# EAGLE design bigmaker (EAGLE 9.7.0)
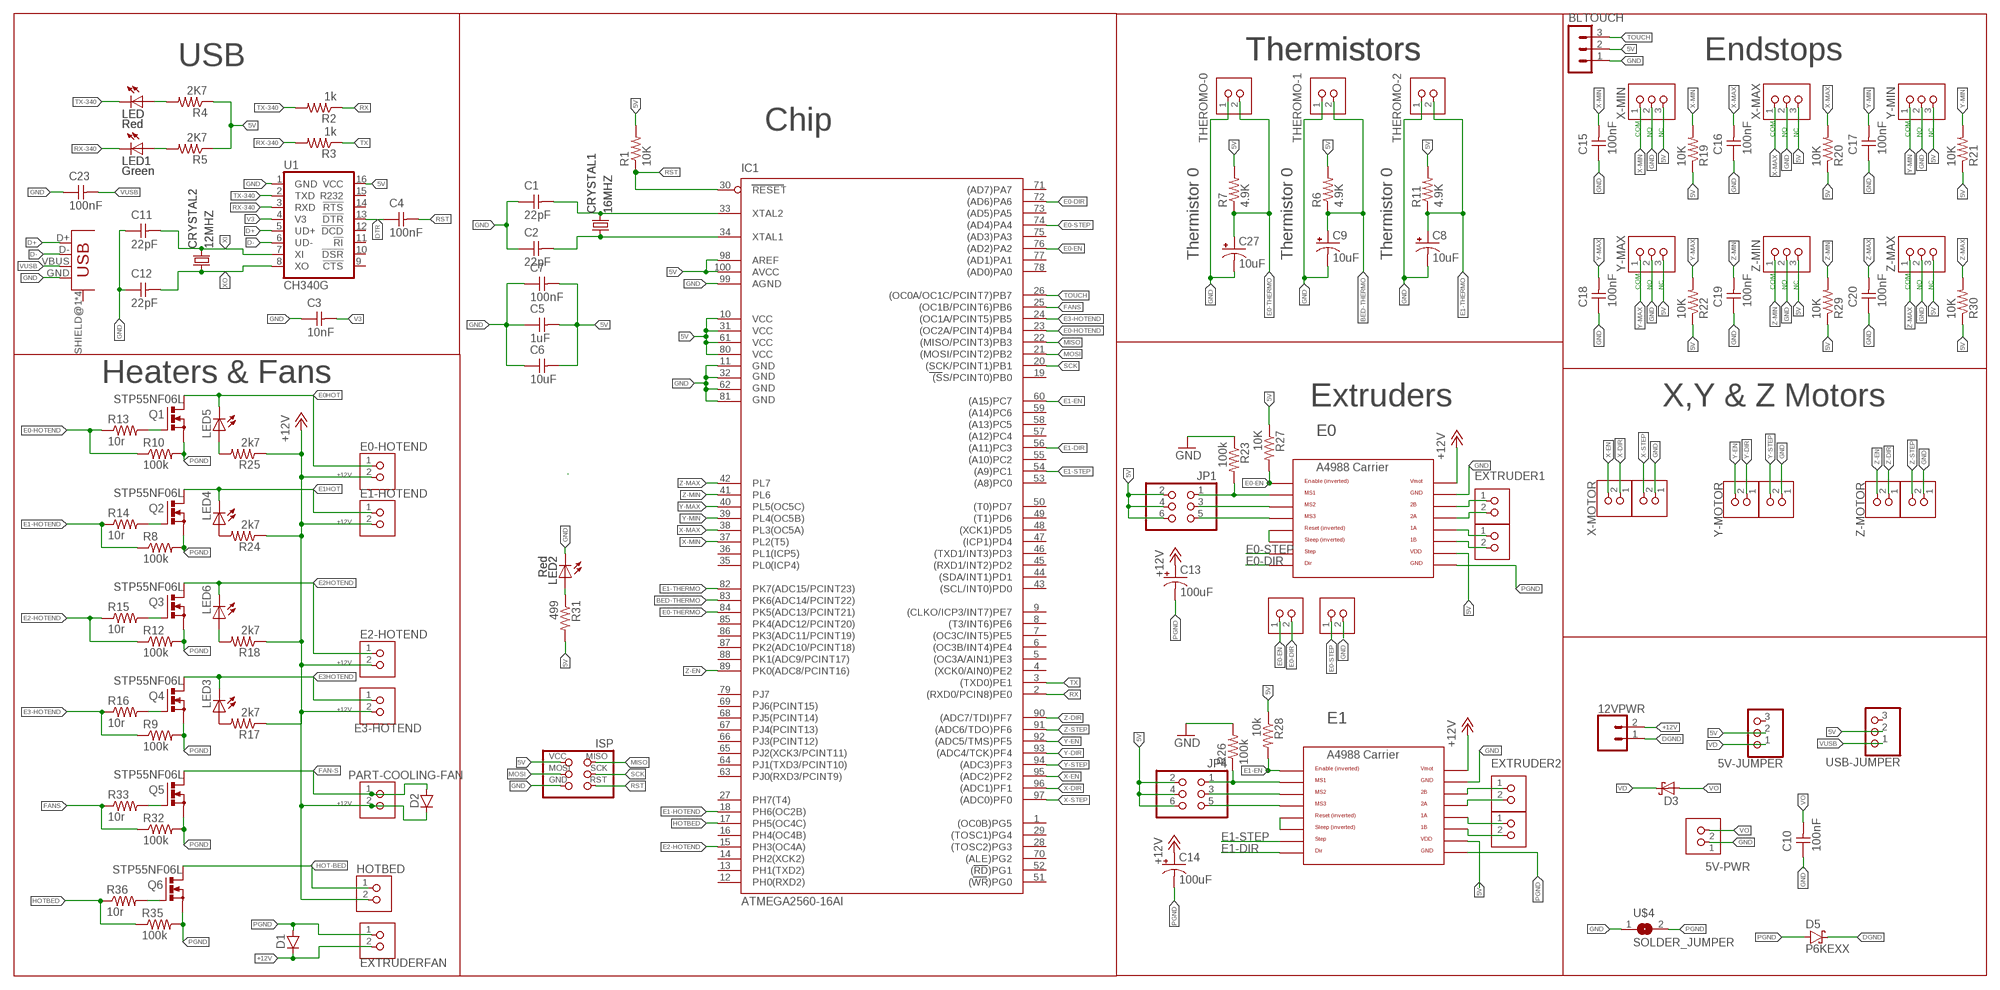
[diagram p0: schematic, sheet 1]

## Parts
5V-JUMPER  PINHD-1X3  [1X03]
5V-PWR  TERM-1X02-FABLAB  [ED555DS-2DS]
12VPWR  CONN_025MM  [SCREWTERMINAL-5MM-2]
BLTOUCH  MA03-1  [MA03-1]
C1  22pF  CAP-UNPOLARIZEDFAB  [C1206FAB]
C2  22pF  CAP-UNPOLARIZEDFAB  [C1206FAB]
C3  10nF  CAP-UNPOLARIZEDFAB  [C1206FAB]
C4  100nF  CAP-UNPOLARIZEDFAB  [C1206FAB]
C5  1uF  CAP-UNPOLARIZEDFAB  [C1206FAB]
C6  10uF  CAP-UNPOLARIZEDFAB  [C1206FAB]
C7  100nF  CAP-UNPOLARIZEDFAB  [C1206FAB]
C8  10uF  CPOL-US153CLV-0405  [153CLV-0405]
C9  10uF  CPOL-US153CLV-0405  [153CLV-0405]
C10  100nF  CAP-UNPOLARIZEDFAB  [C1206FAB]
C11  22pF  CAP-UNPOLARIZEDFAB  [C1206FAB]
C12  22pF  CAP-UNPOLARIZEDFAB  [C1206FAB]
C13  100uF  CPOL-US153CLV-0605  [153CLV-0605]
C14  100uF  CPOL-US153CLV-0605  [153CLV-0605]
C15  100nF  CAP-UNPOLARIZEDFAB  [C1206FAB]
C16  100nF  CAP-UNPOLARIZEDFAB  [C1206FAB]
C17  100nF  CAP-UNPOLARIZEDFAB  [C1206FAB]
C18  100nF  CAP-UNPOLARIZEDFAB  [C1206FAB]
C19  100nF  CAP-UNPOLARIZEDFAB  [C1206FAB]
C20  100nF  CAP-UNPOLARIZEDFAB  [C1206FAB]
C23  100nF  CAP-UNPOLARIZEDFAB  [C1206FAB]
C27  10uF  CPOL-US153CLV-0405  [153CLV-0405]
CRYSTAL1  16MHZ  CSM-7X-DU  [CSM-7X-DU]
CRYSTAL2  12MHZ  CSM-7X-DU  [CSM-7X-DU]
D1  CDBM1100-G  [MINI-SMA]
D2  CDBM1100-G  [MINI-SMA]
D3  SCHOTTKY-DIODEDO35-7  [DO35-7]
D5  P6KEXX  [CB417-15]
E0-HOTEND  TERM-1X02-FABLAB  [ED555DS-2DS]
E1-HOTEND  TERM-1X02-FABLAB  [ED555DS-2DS]
E2-HOTEND  TERM-1X02-FABLAB  [ED555DS-2DS]
E3-HOTEND  TERM-1X02-FABLAB  [ED555DS-2DS]
EXTERNAL-EXTRUDER  TERM-1X02-FABLAB  [ED555DS-2DS]
EXTRUDER1  TERM-1X02-FABLAB  [ED555DS-2DS]
EXTRUDER2  TERM-1X02-FABLAB  [ED555DS-2DS]
EXTRUDER11  TERM-1X02-FABLAB  [ED555DS-2DS]
EXTRUDER22  TERM-1X02-FABLAB  [ED555DS-2DS]
EXTRUDERFAN  TERM-1X02-FABLAB  [ED555DS-2DS]
HOTBED  TERM-1X02-FABLAB  [ED555DS-2DS]
IC1  ATMEGA2560-16AI  [TQFP100]
ISP  AVRISPSMD  [2X03SMD]
JP1  PINHD-2X3  [2X03]
JP4  PINHD-2X3  [2X03]
LED  Red  LEDFAB1206  [LED1206FAB]
LED1  Green  LEDFAB1206  [LED1206FAB]
LED2  Red  LEDFAB1206  [LED1206FAB]
LED3  LEDFAB1206  [LED1206FAB]
LED4  LEDFAB1206  [LED1206FAB]
LED5  LEDFAB1206  [LED1206FAB]
LED6  LEDFAB1206  [LED1206FAB]
PART-COOLING-FAN  TERM-1X02-FABLAB  [ED555DS-2DS]
Q1  STP55NF06L  IRF512  [TO220BV]
Q2  STP55NF06L  IRF512  [TO220BV]
Q3  STP55NF06L  IRF512  [TO220BV]
Q4  STP55NF06L  IRF512  [TO220BV]
Q5  STP55NF06L  IRF512  [TO220BV]
Q6  STP55NF06L  IRF512  [TO220BV]
R1  10K  RES-US1206FAB  [R1206FAB]
R2  1k  RES-US1206FAB  [R1206FAB]
R3  1k  RES-US1206FAB  [R1206FAB]
R4  2K7  RES-US1206FAB  [R1206FAB]
R5  2K7  RES-US1206FAB  [R1206FAB]
R6  4.9K  RES-US1206FAB  [R1206FAB]
R7  4.9K  RES-US1206FAB  [R1206FAB]
R8  100k  RES-US1206FAB  [R1206FAB]
R9  100k  RES-US1206FAB  [R1206FAB]
R10  100k  RES-US1206FAB  [R1206FAB]
R11  4.9K  RES-US1206FAB  [R1206FAB]
R12  100k  RES-US1206FAB  [R1206FAB]
R13  10r  RES-US1206FAB  [R1206FAB]
R14  10r  RES-US1206FAB  [R1206FAB]
R15  10r  RES-US1206FAB  [R1206FAB]
R16  10r  RES-US1206FAB  [R1206FAB]
R17  2k7  RES-US1206FAB  [R1206FAB]
R18  2k7  RES-US1206FAB  [R1206FAB]
R19  10K  RES-US1206FAB  [R1206FAB]
R20  10K  RES-US1206FAB  [R1206FAB]
R21  10K  RES-US1206FAB  [R1206FAB]
R22  10K  RES-US1206FAB  [R1206FAB]
R23  100k  RES-US1206FAB  [R1206FAB]
R24  2k7  RES-US1206FAB  [R1206FAB]
R25  2k7  RES-US1206FAB  [R1206FAB]
R26  100k  RES-US1206FAB  [R1206FAB]
R27  10K  RES-US1206FAB  [R1206FAB]
R28  10k  RES-US1206FAB  [R1206FAB]
R29  10K  RES-US1206FAB  [R1206FAB]
R30  10K  RES-US1206FAB  [R1206FAB]
R31  499  RES-US1206FAB  [R1206FAB]
R32  100k  RES-US1206FAB  [R1206FAB]
R33  10r  RES-US1206FAB  [R1206FAB]
R35  100k  RES-US1206FAB  [R1206FAB]
R36  10r  RES-US1206FAB  [R1206FAB]
THEROMO-0  TERM-1X02-FABLAB  [ED555DS-2DS]
THEROMO-1  TERM-1X02-FABLAB  [ED555DS-2DS]
THEROMO-2  TERM-1X02-FABLAB  [ED555DS-2DS]
U1  CH340G  CH340GSMD  [SO016]
U$1  USB_MINIB  [USB_MINIB]
U$2  A4988BREAKOUT  [A4988BREAKOUT]
U$3  A4988BREAKOUT  [A4988BREAKOUT]
U$4  SOLDER_JUMPER  [SJFAB]
USB-JUMPER  PINHD-1X3  [1X03]
X-MAX  TERM-1X03'-FABLAB'  [ED555DS-3DS]
X-MIN  TERM-1X03'-FABLAB'  [ED555DS-3DS]
X-MOTOR  TERM-1X02-FABLAB  [ED555DS-2DS]
X-MOTOR2  TERM-1X02-FABLAB  [ED555DS-2DS]
XMOTOR2  TERM-1X02-FABLAB  [ED555DS-2DS]
Y-MAX  TERM-1X03'-FABLAB'  [ED555DS-3DS]
Y-MIN  TERM-1X03'-FABLAB'  [ED555DS-3DS]
Y-MOTOR  TERM-1X02-FABLAB  [ED555DS-2DS]
YMOTOR2  TERM-1X02-FABLAB  [ED555DS-2DS]
Z-MAX  TERM-1X03'-FABLAB'  [ED555DS-3DS]
Z-MIN  TERM-1X03'-FABLAB'  [ED555DS-3DS]
Z-MOTOR  TERM-1X02-FABLAB  [ED555DS-2DS]
Z-MOTOR2  TERM-1X02-FABLAB  [ED555DS-2DS]

## Nets
5V: 5V-JUMPER.2 BLTOUCH.2 C5.2 C6.2 C7.2 IC1.10(VCC) IC1.31(VCC1) IC1.61(VCC2) IC1.80(VCC3) IC1.98(AREF) IC1.100(AVCC) ISP.2(VCC) JP1.2 JP1.4 JP1.6 JP4.2 JP4.4 JP4.6 R1.2 R4.1 R5.1 R6.2 R7.2 R11.2 R19.1 R20.1 R21.1 R22.1 R27.1 R28.1 R29.1 R30.1 R31.2 U1.16(VCC) U$2.VDD U$3.VDD USB-JUMPER.2 X-MAX.3 X-MIN.3 Y-MAX.3 Y-MIN.3 Z-MAX.3 Z-MIN.3
+12V: 12VPWR.2 C13.+ C14.+ D1.KATHODE D2.KATHODE E0-HOTEND.2 E1-HOTEND.2 E2-HOTEND.2 E3-HOTEND.2 EXTRUDERFAN.2 HOTBED.2 PART-COOLING-FAN.2 R17.1 R18.1 R24.1 R25.1 U$2.VMOT U$3.VMOT
BED-THERMO: C9.+ IC1.83(PK6(ADC14/PCINT22)) R6.1 THEROMO-1.2
D+: U1.5(UD+) U$1.D+
D-: U1.6(UD-) U$1.D-
DGND: 12VPWR.1 D5.C
DTR: C4.1 U1.13(!DTR)
E0-DIR: EXTERNAL-EXTRUDER.2 IC1.72((AD6)PA6) U$2.DIR
E0-EN: EXTERNAL-EXTRUDER.1 IC1.76((AD2)PA2) R27.2 U$2.EN
E0-HOTEND: IC1.23((OC2A/PCINT4)PB4) R10.1 R13.1
E0-STEP: IC1.74((AD4)PA4) U$2.STEP X-MOTOR2.1
E0-THERMO: C27.+ IC1.84(PK5(ADC13/PCINT21)) R7.1 THEROMO-0.2
E0HOT: E0-HOTEND.1 LED5.2(C) Q1.D
E1-DIR: IC1.56((A11)PC3) U$3.DIR
E1-EN: IC1.60((A15)PC7) R28.2 U$3.EN
E1-HOTEND: IC1.18(PH6(OC2B)) R8.1 R14.1
E1-STEP: IC1.54((A9)PC1) U$3.STEP
E1-THERMO: C8.+ IC1.82(PK7(ADC15/PCINT23)) R11.1 THEROMO-2.2
E1HOT: E1-HOTEND.1 LED4.2(C) Q2.D
E2-HOTEND: IC1.15(PH3(OC4A)) R12.1 R15.1
E2HOTEND: E2-HOTEND.1 LED6.2(C) Q3.D
E3-HOTEND: IC1.24((OC1A/PCINT5)PB5) R9.1 R16.1
E3HOTEND: E3-HOTEND.1 LED3.2(C) Q4.D
FAN-S: D2.ANODE PART-COOLING-FAN.1 Q5.D
FANS: IC1.25((OC1B/PCINT6)PB6) R32.1 R33.1
GND: 5V-PWR.1 BLTOUCH.1 C1.1 C2.1 C3.1 C5.1 C6.1 C7.1 C8.- C9.- C10.1 C11.1 C12.1 C15.1 C16.1 C17.1 C18.1 C19.1 C20.1 C23.1 C27.- IC1.11(GND) IC1.32(GND1) IC1.62(GND2) IC1.81(GND3) IC1.99(AGND) ISP.6(GND) LED2.2(C) R23.1 R26.2 THEROMO-0.1 THEROMO-1.1 THEROMO-2.1 U1.1(GND) U$1.GND U$2.GND U$3.GND U$4.1 X-MAX.2 X-MIN.2 X-MOTOR2.2 XMOTOR2.1 Y-MAX.2 Y-MIN.2 YMOTOR2.1 Z-MAX.2 Z-MIN.2 Z-MOTOR2.1
HOT-BED: HOTBED.1 Q6.D
HOTBED: IC1.17(PH5(OC4C)) R35.1 R36.1
MISO: IC1.22((MISO/PCINT3)PB3) ISP.1(MISO)
MOSI: IC1.21((MOSI/PCINT2)PB2) ISP.4(MOSI)
N$1: C1.2 CRYSTAL1.2 IC1.33(XTAL2)
N$2: C2.2 CRYSTAL1.1 IC1.34(XTAL1)
N$3: LED2.1(A) R31.1
N$4: EXTRUDER22.1 U$3.2B
N$5: EXTRUDER22.2 U$3.2A
N$6: EXTRUDER2.1 U$3.1A
N$7: LED.1(A) R4.2
N$8: LED1.1(A) R5.2
N$9: EXTRUDER2.2 U$3.1B
N$10: Q5.G R33.2
N$12: Q4.G R16.2
N$13: Q3.G R15.2
N$14: LED3.1(A) R17.2
N$15: LED6.1(A) R18.2
N$16: Q6.G R36.2
N$29: JP1.5 U$2.MS3
N$30: U$2.RST U$2.SLP(SLEEP)
N$31: U$3.RST U$3.SLP(SLEEP)
N$32: JP4.1 R26.1 U$3.MS1
N$33: JP1.1 R23.2 U$2.MS1
N$36: JP1.3 U$2.MS2
N$37: JP4.5 U$3.MS3
N$38: JP4.3 U$3.MS2
N$39: EXTRUDER11.1 U$2.2B
N$40: EXTRUDER11.2 U$2.2A
N$41: EXTRUDER1.1 U$2.1A
N$42: EXTRUDER1.2 U$2.1B
N$45: LED4.1(A) R24.2
N$47: Q2.G R14.2
N$48: Q1.G R13.2
N$50: LED5.1(A) R25.2
PGND: C13.- C14.- D1.ANODE D5.A EXTRUDERFAN.1 Q1.S Q2.S Q3.S Q4.S Q5.S Q6.S R8.2 R9.2 R10.2 R12.2 R32.2 R35.2 U$2.GND@0(GND) U$3.GND@0(GND) U$4.2
RST: C4.2 IC1.30(RESET) ISP.5(RST) R1.1
RX: IC1.2((RXD0/PCIN8)PE0) R2.1
RX-340: LED1.2(C) R3.2 U1.3(RXD)
SCK: IC1.20((SCK/PCINT1)PB1) ISP.3(SCK)
TOUCH: BLTOUCH.3 IC1.26((OC0A/OC1C/PCINT7)PB7)
TX: IC1.3((TXD0)PE1) R3.1
TX-340: LED.2(C) R2.2 U1.2(TXD)
V3: C3.2 U1.4(V3)
VD: 5V-JUMPER.1 D3.C
VO: 5V-PWR.2 C10.2 D3.A
VUSB: C23.2 U$1.VBUS USB-JUMPER.1
X-DIR: IC1.96((ADC1)PF1) X-MOTOR.1
X-EN: IC1.95((ADC2)PF2) X-MOTOR.2
X-MAX: C16.2 IC1.38(PL3(OC5A)) R20.2 X-MAX.1
X-MIN: C15.2 IC1.37(PL2(T5)) R19.2 X-MIN.1
X-STEP: IC1.97((ADC0)PF0) XMOTOR2.2
XI: C11.2 CRYSTAL2.2 U1.7(XI)
XO: C12.2 CRYSTAL2.1 U1.8(XO)
Y-DIR: IC1.93((ADC4/TCK)PF4) Y-MOTOR.1
Y-EN: IC1.92((ADC5/TMS)PF5) Y-MOTOR.2
Y-MAX: C18.2 IC1.40(PL5(OC5C)) R22.2 Y-MAX.1
Y-MIN: C17.2 IC1.39(PL4(OC5B)) R21.2 Y-MIN.1
Y-STEP: IC1.94((ADC3)PF3) YMOTOR2.2
Z-DIR: IC1.90((ADC7/TDI)PF7) Z-MOTOR.1
Z-EN: IC1.89(PK0(ADC8/PCINT16)) Z-MOTOR.2
Z-MAX: C20.2 IC1.42(PL7) R30.2 Z-MAX.1
Z-MIN: C19.2 IC1.41(PL6) R29.2 Z-MIN.1
Z-STEP: IC1.91((ADC6/TDO)PF6) Z-MOTOR2.2
Unconnected: 5V-JUMPER.3 IC1.1((OC0B)PG5) IC1.4((XCK0/AIN0)PE2) IC1.5((OC3A/AIN1)PE3) IC1.6((OC3B/INT4)PE4) IC1.7((OC3C/INT5)PE5) IC1.8((T3/INT6)PE6) IC1.9((CLKO/ICP3/INT7)PE7) IC1.12(PH0(RXD2)) IC1.13(PH1(TXD2)) IC1.14(PH2(XCK2)) IC1.16(PH4(OC4B)) IC1.19((SS/PCINT0)PB0) IC1.27(PH7(T4)) IC1.28((TOSC2)PG3) IC1.29((TOSC1)PG4) IC1.35(PL0(ICP4)) IC1.36(PL1(ICP5)) IC1.43((SCL/INT0)PD0) IC1.44((SDA/INT1)PD1) IC1.45((RXD1/INT2)PD2) IC1.46((TXD1/INT3)PD3) IC1.47((ICP1)PD4) IC1.48((XCK1)PD5) IC1.49((T1)PD6) IC1.50((T0)PD7) IC1.51((WR)PG0) IC1.52((RD)PG1) IC1.53((A8)PC0) IC1.55((A10)PC2) IC1.57((A12)PC4) IC1.58((A13)PC5) IC1.59((A14)PC6) IC1.63(PJ0(RXD3/PCINT9)) IC1.64(PJ1(TXD3/PCINT10)) IC1.65(PJ2(XCK3/PCINT11)) IC1.66(PJ3(PCINT12)) IC1.67(PJ4(PCINT13)) IC1.68(PJ5(PCINT14)) IC1.69(PJ6(PCINT15)) IC1.70((ALE)PG2) IC1.71((AD7)PA7) IC1.73((AD5)PA5) IC1.75((AD3)PA3) IC1.77((AD1)PA1) IC1.78((AD0)PA0) IC1.79(PJ7) IC1.85(PK4(ADC12/PCINT20)) IC1.86(PK3(ADC11/PCINT19)) IC1.87(PK2(ADC10/PCINT18)) IC1.88(PK1(ADC9/PCINT17)) U1.9(!CTS) U1.10(!DSR) U1.11(!RI) U1.12(!DCD) U1.14(!RTS) U1.15(R232) U$1.SHIELD@1(SHIELD) U$1.SHIELD@2(SHIELD) U$1.SHIELD@3(SHIELD) U$1.SHIELD@4(SHIELD) USB-JUMPER.3

## Notes on the sheet
- USB | Thermistors | Thermistors | Endstops
- Chip
- COM | NO | NC | COM | NO | NC | COM | NO | NC
- Thermistor 0 | Thermistor 0 | Thermistor 0
- COM | NO | NC | COM | NO | NC | COM | NO | NC
- Heaters & Fans
- Extruders | X,Y & Z Motors
- E0
- E1

## Library data of the parts
5V-JUMPER USB-JUMPER = pinhead:PINHD-1X3: PIN HEADER
5V-PWR E0-HOTEND E1-HOTEND E2-HOTEND E3-HOTEND EXTERNAL-EXTRUDER EXTRUDER1 EXTRUDER2 EXTRUDER11 EXTRUDER22 EXTRUDERFAN HOTBED PART-COOLING-FAN THEROMO-0 THEROMO-1 THEROMO-2 X-MOTOR X-MOTOR2 XMOTOR2 Y-MOTOR YMOTOR2 Z-MOTOR Z-MOTOR2 = fab:TERM-1X02: 3.5mm terminal block, 2 positions ED555-2DS as found in the fablab inventory. Stolen from Adafruit <http://www.ladyada.net/library/pcb/eaglelibrary.html>, adapted by Zaerc.
12VPWR = SparkFun-Retired:CONN_02: Multi connection point. Often used as Generic Header-pin footprint for 0.1 inch spaced/style header connections On any of the 0.1 inch spaced packages, you can populate with these: Break Away Headers - Straight <https://www.sparkfun.com/products/116> (PRT-00116) Break Away Male Headers - Right Angle <https://www.sparkfun.com/products/553> (PRT-00553) Female Headers <https://www.sparkfun.com/products/115> (PRT-00115) Break Away Headers - Machine Pin <https://www.sparkfun.com/products/117> (PRT-00117) Break Away Female Headers - Swiss Machine Pin <https://www.sparkfun.com/products/743> (PRT-00743) For SCREWTERMINALS and SPRING TERMINALS visit here: Screw Terimnals on SparkFun.com <https://www.sparkfun.com/search/results?term=Screw+Terminals> (5mm/3.5mm/2.54mm spacing) This device is also useful as a general connection point to wire up your design to another part of your project. Our various solder wires solder well into these plated through hole pads. Hook-Up Wire - Assortment (Stranded, 22 AWG) <https://www.sparkfun.com/products/11375> (PRT-11375) Hook-Up Wire - Assortment (Solid Core, 22 AWG) <https://www.sparkfun.com/products/11367> (PRT-11367) View the entire wire category on our website here <https://www.sparkfun.com/categories/141> Special notes: Molex polarized connector foot print use with: PRT-08233 with associated crimp pins and housings. 2.54_SCREWTERM for use with PRT-10571. 3.5mm Screw Terminal footprints for PRT-08084 5mm Screw Terminal footprints for use with PRT-08432; SF_SKU: PRT-08432
BLTOUCH = MACHINE:MA03-1: PIN HEADER; OC_FARNELL: unknown; OC_NEWARK: unknown
C1-C7 C10-C12 C15-C20 C23 = fab:CAP-UNPOLARIZED
C8 C9 C13 C14 C27 = adafruit:CPOL-US: POLARIZED CAPACITOR, American symbol
CRYSTAL1 CRYSTAL2 = bigfdmmain:CSM-7X-DU: SMD CRYSTAL Source: www.ecsxtal.com .. Crystal 3.6864MHz CSM_7X_DU.PDF; OC_FARNELL: unknown; OC_NEWARK: unknown
D1 D2 = fab:CDBM1100-G: Diode schottky 100V 1A mini-SMA as found in the fablab inventory Reverse Voltage: 100 Volts Forward Current: 1.0 Amp Maximum forward voltage: 0.85 Volts Made by Zaerc.
D3 = adafruit:SCHOTTKY-DIODE: Schottky Diode
D5 = diode:P6KEXX: DIODE transient-voltage suppressor
IC1 = atmel-2005:ATMEGA*: MICROCONTROLLER 64/128/256 Kbytes FLASH 4 Kbytes EEPROM 8 Kbytes SRAM 86 General Purpose I/O pins 12-channels16-bit PWM 4 x Serial USARTs 16-channels 10-bit A/D
ISP = fab:AVRISP
JP1 JP4 = pinhead:PINHD-2X3: PIN HEADER
LED LED1 LED2 = bigfdmmain:LED*?: LED
LED3-LED6 = fab:LED: LED
Q1-Q6 = transistor-power:IRF512: N-CHANNEL MOS FET
R1-R5 = bigfdmmain:RES-US: Resistor (US Symbol) Variants with postfix FAB are widened to allow the routing of internal traces
R6-R33 R35 R36 = fab:RES-US: Resistor (US Symbol) Variants with postfix FAB are widened to allow the routing of internal traces
U1 = bigfdmmain:CH340G: A simple USB 2.0 to Serial IC.; PROD_ID: IC-13498
U$1 = MACHINE:USB_MINIB
U$2 U$3 = RepRapjr:A4988BREAKOUT
U$4 = fab:SOLDER_JUMPER
X-MAX X-MIN Y-MAX Y-MIN Z-MAX Z-MIN = fab:TERM-1X03: 3.5mm terminal block, 3 positions ED555-3DS as found in the fablab inventory. Made by Zaerc.

## Board
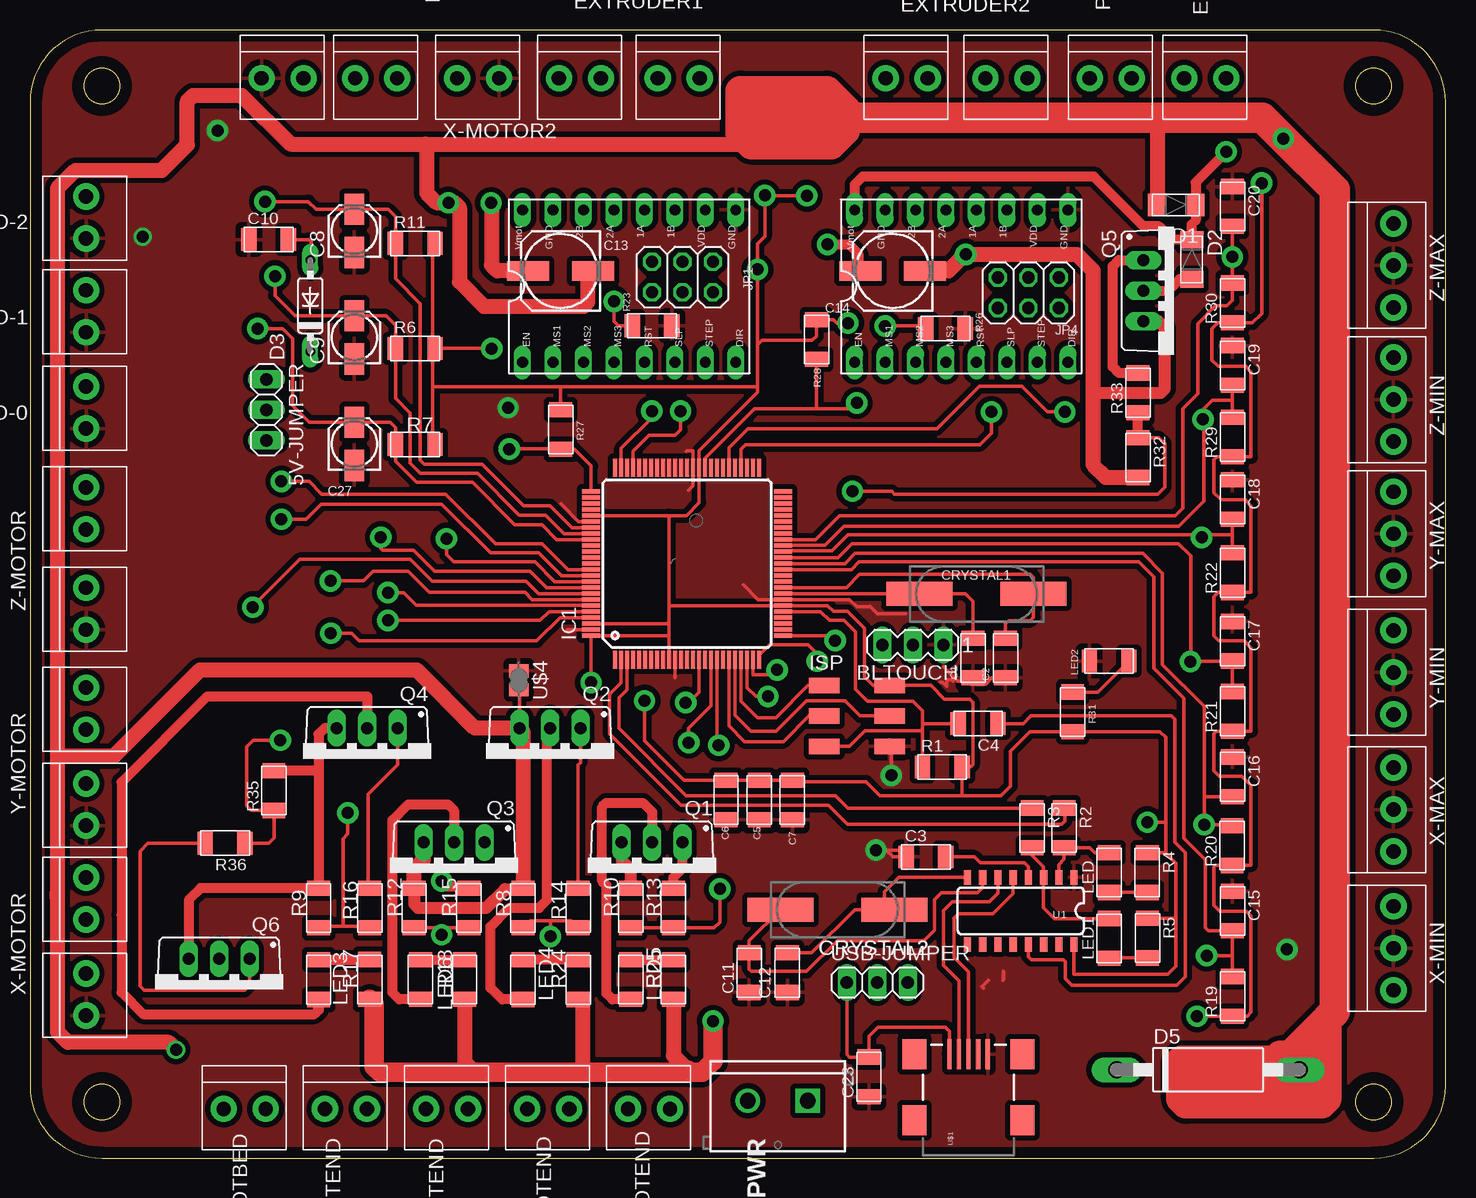
[diagram p1: board, top side]
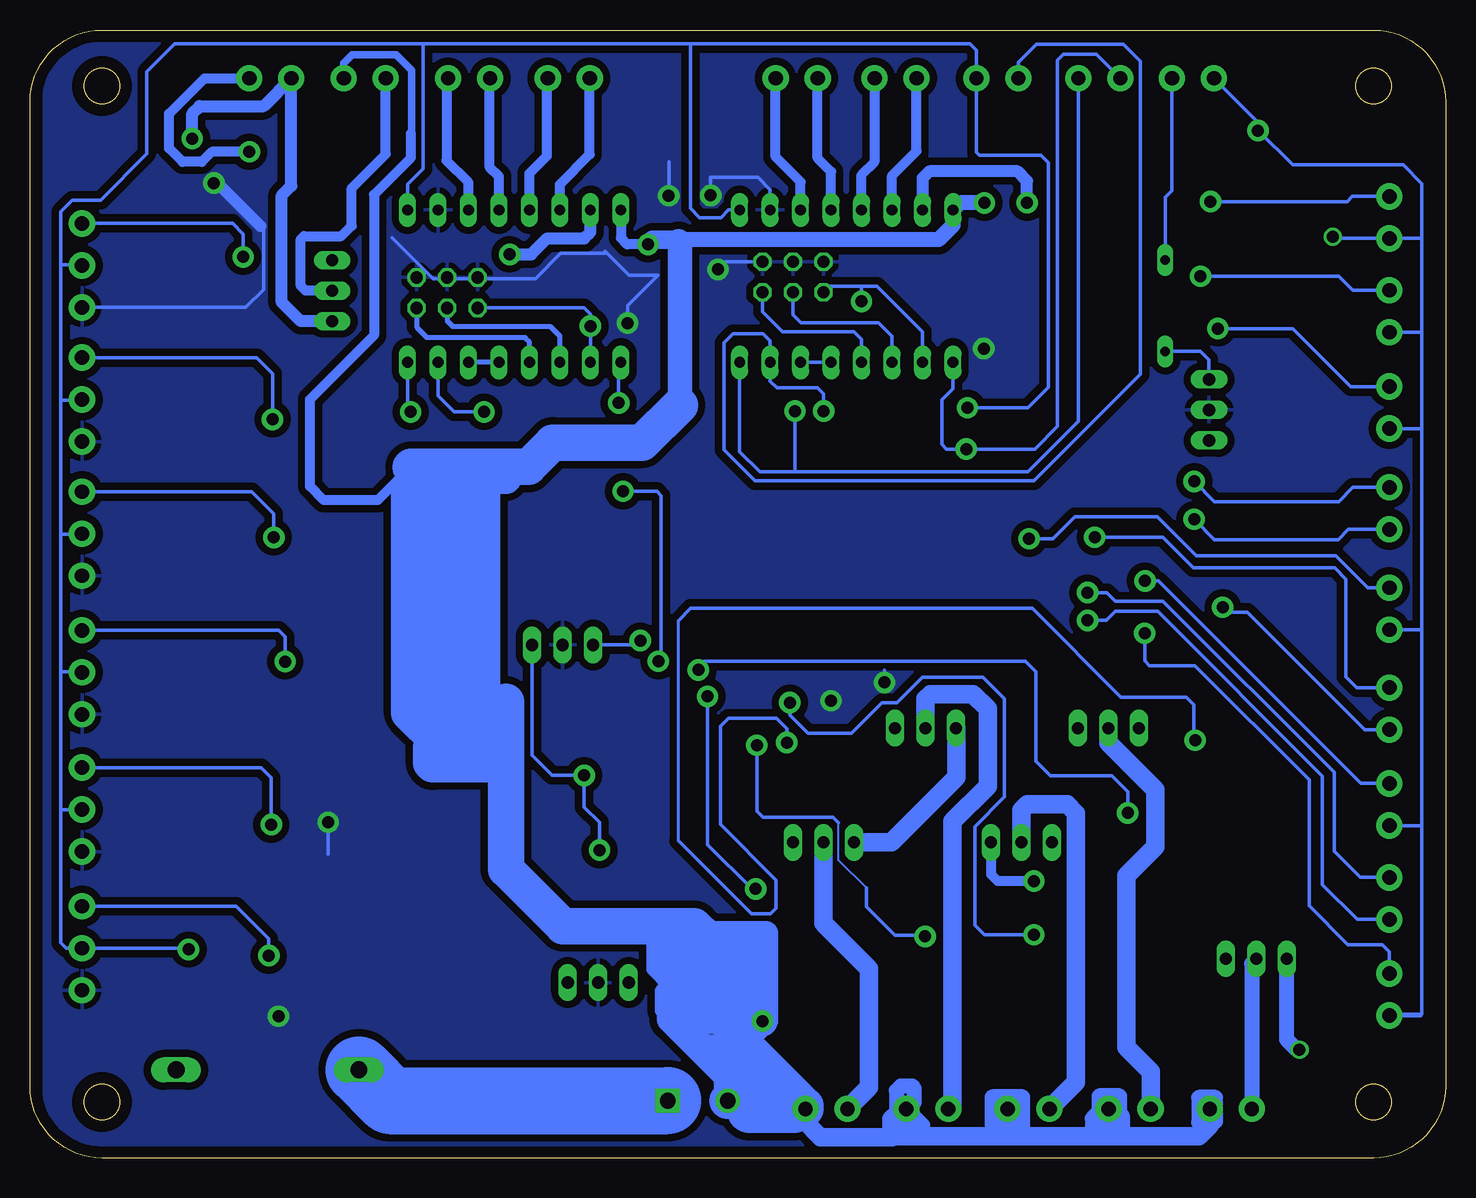
[diagram p2: board, bottom side, seen from below]

Size 118 x 94 mm. Coordinates in mm from the lower left corner, seen from the top.
Outline: 118,6 118,88 arc90 112,94 6,94 arc90 0,88 0,6 arc90 6,0 112,0 arc90 118,6
Outline: circle at 112,4.67 radius 1.5
Outline: circle at 112,89.33 radius 1.5
Outline: circle at 6,89.33 radius 1.5
Outline: circle at 6,4.67 radius 1.5
Copper layers (1*16): Top 0.035mm / dielectric 1.5mm / Bottom 0.035mm
Design rules "default *": minimum track width 12mil, minimum drill 0.35mm, track to track 17mil, track to pad 17mil, pad to pad 17mil, via to via 17mil, smd to smd 17mil, copper to edge 38mil, drill to drill 6mil, minimum pad ring 10mil, minimum via ring 8mil, stop-mask expansion 4mil, vias tented up to drill 0mil, thermal gap 20mil

### Footprints (pad centres in the part's own frame; a part is rotated, then mirrored left to right if it is on the bottom)
1X03 = drill 1.016 long: 1 -2.54,0; 2 0,0; 3 2.54,0
ED555DS-2DS = drill 1.2 pad 2.184: 1 1.8,0; 2 -1.7,0
SCREWTERMINAL-5MM-2 = drill 1.3 pad 2.032 square: 1 0,0 | drill 1.3 pad 2.032: 2 5,0
MA03-1 = drill 1.016 long: 1 -2.54,0; 2 0,0; 3 2.54,0
C1206FAB = smd 1.27 x 1.905: 1 -1.651,0; 2 1.651,0
153CLV-0405 = smd 2.6 x 1.6: + 1.8,0; - -1.8,0
153CLV-0605 = smd 3.5 x 1.6: + 2.7,0; - -2.7,0
CSM-7X-DU = smd 5.5 x 2: 1 -4.75,0; 2 4.75,0
MINI-SMA = smd 1.4 x 1.9: ANODE 1.65,0; KATHODE -1.65,0
DO35-7 = drill 0.813 long: A 3.81,0; C -3.81,0
CB417-15 = drill 1.397 long: A 7.62,0; C -7.62,0
TQFP100 = smd 1.5 x 0.35: 1 -8,6; 2 -8,5.5; 3 -8,5; 4 -8,4.5; 5 -8,4; 6 -8,3.5; 7 -8,3; 8 -8,2.5; 9 -8,2; 10 -8,1.5; 11 -8,1; 12 -8,0.5; 13 -8,0; 14 -8,-0.5; 15 -8,-1; 16 -8,-1.5; 17 -8,-2; 18 -8,-2.5; 19 -8,-3; 20 -8,-3.5; 21 -8,-4; 22 -8,-4.5; 23 -8,-5; 24 -8,-5.5; 25 -8,-6; 51 8,-6; 52 8,-5.5; 53 8,-5; 54 8,-4.5; 55 8,-4; 56 8,-3.5; 57 8,-3; 58 8,-2.5; 59 8,-2; 60 8,-1.5; 61 8,-1; 62 8,-0.5; 63 8,0; 64 8,0.5; 65 8,1; 66 8,1.5; 67 8,2; 68 8,2.5; 69 8,3; 70 8,3.5; 71 8,4; 72 8,4.5; 73 8,5; 74 8,5.5; 75 8,6 | smd 0.35 x 1.5: 26 -6,-8; 27 -5.5,-8; 28 -5,-8; 29 -4.5,-8; 30 -4,-8; 31 -3.5,-8; 32 -3,-8; 33 -2.5,-8; 34 -2,-8; 35 -1.5,-8; 36 -1,-8; 37 -0.5,-8; 38 0,-8; 39 0.5,-8; 40 1,-8; 41 1.5,-8; 42 2,-8; 43 2.5,-8; 44 3,-8; 45 3.5,-8; 46 4,-8; 47 4.5,-8; 48 5,-8; 49 5.5,-8; 50 6,-8; 76 6,8; 77 5.5,8; 78 5,8; 79 4.5,8; 80 4,8; 81 3.5,8; 82 3,8; 83 2.5,8; 84 2,8; 85 1.5,8; 86 1,8; 87 0.5,8; 88 0,8; 89 -0.5,8; 90 -1,8; 91 -1.5,8; 92 -2,8; 93 -2.5,8; 94 -3,8; 95 -3.5,8; 96 -4,8; 97 -4.5,8; 98 -5,8; 99 -5.5,8; 100 -6,8
2X03SMD = smd 2.54 x 1.27: 1 -2.54,2.54; 2 2.92,2.54; 3 -2.54,0; 4 2.92,0; 5 -2.54,-2.54; 6 2.92,-2.54
2X03 = drill 1.016 octagon: 1 -2.54,-1.27; 2 -2.54,1.27; 3 0,-1.27; 4 0,1.27; 5 2.54,-1.27; 6 2.54,1.27
LED1206FAB = smd 1.27 x 1.905: 1 -1.651,0; 2 1.651,0
TO220BV = drill 1.016 long: D 0,-2.54; G -2.54,-2.54; S 2.54,-2.54
R1206FAB = smd 1.27 x 1.905: 1 -1.651,0; 2 1.651,0
SO016 = smd 0.6 x 1.2: 1 -4.445,-2.8; 2 -3.175,-2.8; 3 -1.905,-2.8; 4 -0.635,-2.8; 5 0.635,-2.8; 6 1.905,-2.8; 7 3.175,-2.8; 8 4.445,-2.8; 9 4.445,2.8; 10 3.175,2.8; 11 1.905,2.8; 12 0.635,2.8; 13 -0.635,2.8; 14 -1.905,2.8; 15 -3.175,2.8; 16 -4.445,2.8
USB_MINIB = smd 2.5 x 0.35: D+ 3.77,0; D- 3.77,0.8; GND 3.77,-1.6; ID 3.77,-0.8; VBUS 3.77,1.6 | smd 2.5 x 2: SHIELD@1 -1.73,-4.5; SHIELD@2 -1.73,4.5; SHIELD@3 3.77,4.5; SHIELD@4 3.77,-4.5
A4988BREAKOUT = drill 0.9 pad 1.27 long: 1A 8.89,1.27; 1B 11.43,1.27; 2A 6.35,1.27; 2B 3.81,1.27; DIR 16.51,-11.43; EN -1.27,-11.43; GND 16.51,1.27; GND@0 1.27,1.27; MS1 1.27,-11.43; MS2 3.81,-11.43; MS3 6.35,-11.43; RST 8.89,-11.43; SLP 11.43,-11.43; STEP 13.97,-11.43; VDD 13.97,1.27; VMOT -1.27,1.27
SJFAB = smd 1.118 x 1.6: 1 -0.787,0; 2 0.787,0
ED555DS-3DS = drill 1.2 pad 2.184: 1 -3.5,0; 2 0,0; 3 3.5,0

### Placement (x,y rotation side)
5V-JUMPER  19.71,62.34 270 top
5V-PWR  21.1,89.98 180 top
12VPWR  64.85,4.77 180 top
BLTOUCH  73.6,42.76 180 top
C1  78.61,41.67 90 top
C2  81.32,41.67 90 top
C3  74.69,25.08 0 top
C4  79.03,36.21 180 top
C5  60.79,29.83 90 top
C6  58.02,29.83 90 top
C7  63.56,29.83 90 top
C8  27.04,77.26 90 top
C9  27.04,68.38 90 top
C10  19.89,76.54 0 top
C11  59.95,15.44 90 top
C12  63.14,15.44 90 top
C13  44.23,73.92 180 top
C14  71.92,73.92 180 top
C15  100.24,20.58 270 top
C16  100.24,31.76 270 top
C17  100.24,43.06 270 top
C18  100.24,54.87 270 top
C19  100.24,66.05 270 top
C20  100.24,79.3 270 top
C23  69.94,6.76 90 top
C27  27.04,59.51 90 top
CRYSTAL1  78.91,47 180 top
CRYSTAL2  67.31,20.7 180 top
D1  95.53,79.42 180 top
D2  96.85,74.88 270 top
D3  23.37,71.03 90 top
D5  98.2,7.35 0 top
E0-HOTEND  51.65,4.1 180 top
E1-HOTEND  43.25,4.1 180 top
E2-HOTEND  34.81,4.1 180 top
E3-HOTEND  26.38,4.1 180 top
EXTERNAL-EXTRUDER  28.91,89.98 180 top
EXTRUDER1  54.14,89.98 180 top
EXTRUDER2  81.45,89.98 180 top
EXTRUDER11  45.9,89.98 180 top
EXTRUDER22  73.14,89.98 180 top
EXTRUDERFAN  98.02,89.98 180 top
HOTBED  17.95,4.1 180 top
IC1  54.78,49.54 90 top
ISP  68.75,36.84 0 top
JP1  54.39,73.42 0 top
JP4  83.23,72.11 0 top
LED  89.96,23.79 90 top
LED1  89.96,18.3 90 top
LED2  89.95,41.41 180 top
LED3  24.06,14.86 270 top
LED4  41.09,14.86 270 top
LED5  50.08,14.87 270 top
LED6  32.55,14.87 270 top
PART-COOLING-FAN  90.14,89.98 180 top
Q1  51.85,23.76 180 top
Q2  43.35,33.28 180 top
Q3  35.34,23.76 180 top
Q4  28.11,33.28 180 top
Q5  95.35,72.27 270 top
Q6  15.77,14.06 180 top
R1  76.05,32.59 0 top
R2  86.21,27.51 270 top
R3  83.54,27.51 270 top
R4  93.14,23.79 270 top
R5  93.16,18.33 270 top
R6  32.11,67.46 0 top
R7  32.11,59.46 0 top
R8  41.09,20.84 90 top
R9  24.06,20.84 90 top
R10  50.08,20.84 90 top
R11  32.11,76.22 0 top
R12  32.02,20.84 90 top
R13  53.63,20.84 90 top
R14  45.7,20.84 90 top
R15  36.59,20.84 90 top
R16  28.33,20.84 90 top
R17  28.33,14.88 90 top
R18  36.23,14.87 90 top
R19  100.24,13.47 90 top
R20  100.21,26.03 90 top
R21  100.24,37.22 90 top
R22  100.24,48.78 90 top
R23  51.85,69.35 180 top
R24  45.7,14.86 90 top
R25  53.63,14.87 90 top
R26  76.31,69.12 0 top
R27  44.23,60.71 270 top
R28  65.57,68.21 270 top
R29  100.24,60.08 90 top
R30  100.24,71.26 90 top
R31  86.92,37.18 270 top
R32  92.37,58.37 270 top
R33  92.37,63.76 90 top
R35  20.34,30.62 90 top
R36  16.27,26.24 180 top
THEROMO-0  4.68,62.59 270 top
THEROMO-1  4.68,70.61 270 top
THEROMO-2  4.68,78.43 270 top
U1  82.59,20.58 180 top
U$1  78.23,4.88 90 top
U$2  42.33,77.73 0 top
U$3  70.02,77.73 0 top
U$4  40.75,39.81 270 top
USB-JUMPER  70.63,14.62 0 top
X-MAX  113.66,29.04 270 top
X-MIN  113.66,17.48 270 top
X-MOTOR  4.68,21.68 270 top
X-MOTOR2  37.4,89.98 180 top
XMOTOR2  4.68,13.67 270 top
Y-MAX  113.66,52.02 270 top
Y-MIN  113.66,40.47 270 top
Y-MOTOR  4.68,37.5 270 top
YMOTOR2  4.68,29.5 270 top
Z-MAX  113.66,74.38 270 top
Z-MIN  113.66,63.2 270 top
Z-MOTOR  4.68,54.19 270 top
Z-MOTOR2  4.68,45.82 270 top

### Tracks (layer width: path | path; a pad name or v marks a point on that pad's centre or on a via)
5V  (via drill 1 pad 1.78)
  Top 0.305: IC1.80 53.25,53.54 | 53.25,53.54 54.71,53.54 55.77,54.6 IC1.61 55.77,58.94 60.65,63.81 60.65,64.27 | IC1.10 53.27,43.45 | 53.27,43.45 53.27,44.72 | 53.27,44.72 53.27,45.98 | 53.27,45.98 53.27,53.52 53.25,53.54 | 53.27,43.45 53.18,43.54 IC1.100 v46.77,39.63 | IC1.98 53.1,44.54 53.27,44.72 | 53.27,45.98 53.33,46.04 IC1.31 66.46,46.04 66.96,45.54 68.15,45.54 69.55,44.15 69.55,40.12 70.29,39.38 ISP.2 75.08,39.38 76.23,38.24 78.33,38.24 78.6,37.97 78.6,32.77 78.42,32.59 R1.2 77.7,30.23 77.66,30.19 | U1.16 87.03,15.31 94.84,15.31 95.51,15.98 95.51,19.98 | R5.1 95.51,19.98 | 33.54,64.4 33.54,64.27 | 33.54,64.27 33.54,59.68 R7.2 | R6.2 33.54,67.24 33.54,64.4 | R11.2 33.57,76.03 33.57,69.64 | R28.1 | 94.68,25.41 94.68,25.38 95.51,24.55 95.51,19.98 | 94.68,25.41 94.68,27.98 | 77.66,30.19 70.84,30.19 69.69,31.34 63.7,31.34 C7.2 C5.2 C6.2 54.51,31.48 51.24,34.75 v51.24,38.11 v51.23,38.11 | R4.1 94.66,25.44 94.68,25.41 | 77.66,30.19 80.92,30.19 81.73,31 81.73,33.89 83.37,35.52 R31.2 94.2,35.52 94.68,35.05 94.68,27.98 | v93.14,27.98 94.68,27.98 | R20.1 100.22,24.4 | 100.22,24.4 101.78,24.4 101.78,31.07 101.03,31.82 99.14,31.82 98.7,32.25 98.7,35.37 98.91,35.57 R21.1 101.78,35.57 101.78,42.54 101.21,43.11 99.11,43.11 98.7,43.52 98.7,46.78 99.05,47.13 R22.1 101.78,47.13 101.78,54.37 101.31,54.83 99.3,54.83 98.7,55.43 98.7,58.19 98.94,58.43 R29.1 101.78,58.43 101.78,65.53 101.33,65.97 99.05,65.97 98.53,66.5 98.53,69.1 99.03,69.61 R30.1 101.91,69.6 102.67,70.36 v102.67,81.24 | 100.22,24.4 98.84,24.4 98.7,24.26 98.7,21.05 99.19,20.57 101.39,20.57 101.78,20.18 101.78,12.14 101.46,11.82 R19.1 v97.29,11.82
  Top 0.305: 44.25,64.27 33.54,64.27 | 33.54,64.4 | R6.2 33.57,67.66 | 44.25,64.27 44.23,64.25 R27.1 | 60.65,67.77 v60.65,74.05 60.65,76.19 61.25,76.8 v61.25,80.22 61.28,80.19 64.74,80.19 v64.75,80.18 | 60.65,67.77 60.65,64.27 | 44.25,64.27 60.65,64.27 | 60.65,67.77 61.01,68.13 65.21,68.13 65.57,68.49 R28.1 | R6.2 38.48,67.46 v38.49,67.45 | 33.57,69.64 | R28.1 66.98,69.86 67.27,69.57 v68.19,69.57 | 33.57,69.64 33.57,67.66 R6.2
  Bottom 0.305: v46.77,39.63 46.77,40.65 | 58.97,74.69 JP1.6 60.01,74.69 v60.65,74.05 | 93.14,25.32 v93.14,27.98 | 87.81,76.7 84.39,73.27 75.87,73.27 73.76,75.39 70.08,75.39 70.08,75.58 68.05,73.54 65.67,73.54 68.2,71 68.2,69.59 v68.19,69.57 | U$2.VDD 56.3,80.7 57.33,81.72 61.25,81.72 61.25,80.26 | 61.25,80.26 | v61.25,80.22 61.25,80.26 | v64.75,80.18 v64.75,80.19 64.75,83.04 | Z-MAX.3 100,70.88 98.53,72.35 98.53,77.4 98.81,77.68
  Bottom 1.016: 98.81,77.68 102.37,81.24 v102.67,81.24
  pour Bottom (isolate 0.61): 1.09,0.3 116.8,0.3 116.8,93.57 1.09,93.57
+12V  (via drill 1 pad 1.78)
  Top 0.305: D1.KATHODE | 97.18,78.14 96.83,77.79 | 96.83,76.55 D2.KATHODE | v66.48,76.14
  Top 0.813: C14.+ 69.05,74.1 69.05,75.35 68.26,76.14 v66.48,76.14 | 54.87,7.3 55.04,7.13 | 46.4,7.13 46.42,7.15 | U$3.VMOT 68.75,81.12 69.4,81.77 88.69,81.77 92.83,77.63 94.13,77.63 95.24,76.53 D2.KATHODE | v99.72,83.85 97.17,81.3 D1.KATHODE | D1.KATHODE 97.18,78.14 | 96.83,77.79 96.83,76.55
  Top 1.27: R25.1 53.63,8.54 54.87,7.3 | R18.1 36.25,13.21 36.25,7.98 37.07,7.15 | R24.1 46.08,12.83 46.08,7.2 46.15,7.13 | C13.+ 38.94,73.92 38.46,74.4 38.46,79.56 v38.44,79.58
  Top 1.626: 55.04,7.13 46.4,7.13 46.15,7.13 | 46.42,7.15 37.07,7.15 29.17,7.15 28.71,7.62 28.71,12.85 R17.1 | 54.87,7.3 55.04,7.13 | 55.04,7.13 56.02,7.13 56.94,8.05 v56.94,11.41
  Bottom 0.305: 63.92,76.4 63.92,76.53 63.48,76.97 | 58.98,9.97 57.63,6.28 57.23,5.89 | 57.23,5.89 | 57.23,5.89 57.48,5.64 58.27,6.44 58.21,6.5 58.11,6.4 57.84,6.4 | 44.95,2.08 45.8,2.08 46.08,1.81 46.14,1.75 | 78.01,57.59 79.03,56.57 79.03,35.66 | v56.94,11.41 56.94,12 60.56,15.62 | 78.31,56.62 79.69,55.25 80.07,55.25 | 61.01,11.6 61.63,10.98 61.63,9.69
  Bottom 0.559: 86.18,85.42 86.23,85.37
  Bottom 0.61: PART-COOLING-FAN.2 91.84,91.25 91.14,91.95 87.47,91.95 86.18,90.66 86.18,85.42
  Bottom 0.813: v66.48,76.14 68.21,76.14 68.75,76.67 U$3.VMOT | E0-HOTEND.2 53.35,2.99 | 36.51,2.13 36.26,1.87 36.19,1.81 | 36.49,1.87 36.42,1.81 | 91.8,89.93 PART-COOLING-FAN.2 91.91,90.04 | 86.23,85.37 86.23,83.36 89.32,80.28 89.32,68.56 94.66,63.23 94.66,55.96 93.51,54.82 89.01,54.82 86.26,57.57 | v99.72,83.85 102.84,83.85 103.68,83.01 105.28,83.01 106.41,84.14 106.41,87.03 103.45,89.98 EXTRUDERFAN.2
  Bottom 1.016: 53.35,2.99 53.12,2.75 | 52.49,2.12 52.11,1.75
  Bottom 1.27: 63.92,76.53 42.26,76.53 41.06,77.73 U$2.VMOT 40.48,79.58 v38.44,79.58 | 43.59,1.81 43.59,2.75 E1-HOTEND.2 44.81,4.1 44.28,4.64 44.28,5.8 44.46,5.98 45.42,5.98 45.78,5.62 45.78,3.83 46.34,3.28 46.34,2.68 | E2-HOTEND.2 37.8,2.81 37.8,5.07 37.77,5.09 35.23,5.09 35.23,1.81 | 28.88,3.87 29.44,3.3 29.44,2.45 28.08,3.82 28.08,4.41 | 26.95,2.53 26.95,3.54 27.16,3.74 | 27.16,3.74 27.16,3.18 E3-HOTEND.2 28.88,3.3 28.88,3.87 | 27.16,3.74 27.16,5.17 28.88,5.17 28.88,3.87 | 19.18,3.04 19.18,3.64 HOTBED.2 19.18,4.56 19.18,5.04 20.58,5.04 20.58,2.95 | 62.8,13.39 58.93,13.39 57.25,11.71 | 62.1,12.7 62.94,12.7 63.9,13.66 64.73,14.49 | 65.99,17.69 65.99,15.76 64.73,14.49 | 64.73,14.49 65.29,13.93 65.29,12.27 56.24,12.27 56.24,11.39 57.95,9.69 61.63,9.69
  Bottom 1.524: 52.11,1.75 46.14,1.75 | 46.08,1.81 43.59,1.81 36.42,1.81 | 36.49,1.87 36.26,1.87 | E2-HOTEND.2 36.51,2.13 | 54.33,3.97 53.12,2.75 52.49,2.12 | HOTBED.2 19.65,2.71 20.55,1.81 28.21,1.81 | 36.19,1.81 35.23,1.81 28.21,1.81 | 28.08,4.41 E3-HOTEND.2 28.08,1.93 28.21,1.81 | E1-HOTEND.2 44.95,2.08 44.94,2.07 | 63.92,76.53 66.09,76.53 v66.48,76.14
  Bottom 2.032: 63.92,76.4 63.83,76.31 63.83,62.75 | 56.88,17.05 56.65,17.28 56.65,18.74 61.12,18.74 61.58,18.28 | E0-HOTEND.2 53.27,4.02
  Bottom 2.54: 57.15,11.41 v56.94,11.41 | 61.7,18.4 61.58,18.28 61.58,15.18 63.72,15.18 63.72,17.05 56.88,17.05 56.88,12.08 57.25,11.71 | 62.8,13.39 62.1,12.7 | 62.1,12.7 61.01,11.6 | 61.01,11.6 64.48,11.6 | 61.01,11.6 58.39,11.6 58.44,11.55 59.08,11.55 59.46,11.55 | 62.1,12.7 61.53,13.28 | 56.01,3.97 56.84,3.97 64.48,11.6 | 78.31,56.62 85.22,56.62 85.22,44.9 85.22,38.87 82.33,35.97 | 78.31,38.03 83.67,38.03 83.67,55.25 80.07,55.25 80.07,39.71 81.97,39.71 81.97,54.64 | 64.48,11.6 64.48,13.07 63.9,13.66
  Bottom 3.048: 62.63,19.33 73.57,19.33 78.31,24.07 78.31,38.03 | 62.63,19.33 61.7,18.4 | 12VPWR.2 59.46,5.16 59.46,11.55 | 59.08,11.55 59.08,15.16 | E0-HOTEND.2 53.35,4.34 58.98,9.97 | 57.25,11.71 57.25,12.31 60.56,15.62 | 62.63,19.33 64.99,16.97 | 63.83,62.75 66.97,59.61 74.42,59.61 76.44,57.59 78.01,57.59 86.25,57.59 86.26,57.57 | 82.33,35.97 82.02,35.66 79.03,35.66 79.03,32.81 84.44,32.81 84.55,32.92 84.55,34.21 84.03,34.72 84.03,34.78 86.38,37.12 86.38,55.21 85.78,55.8 85.22,55.24 85.22,44.9
  Bottom 3.81: 54.33,3.97 56.01,3.97 58.01,3.97
BED-THERMO  (via drill 1 pad 1.78)
  Top 0.305: IC1.83 44.53,52.04 43,53.57 40.79,53.57 37.31,57.05 32.53,57.05 31.7,57.88 31.7,62.06 30.46,63.3 R6.1 30.46,69.39 29.67,70.19 C9.+ 22.1,70.19 20.43,71.86 v20.43,73.48
  Bottom 0.305: v20.42,73.49 v20.43,73.48 8.89,73.48 7.72,72.31 THEROMO-1.2
D+
  Top 0.305: U1.5 81.94,23.37 81.94,22.02 80.27,20.35 77.41,20.35 77.03,19.97 77.03,16.75 78.23,15.54 U$1.D+
D-
  Top 0.305: U1.6 80.68,22.06 80,21.37 76.92,21.37 76.17,20.62 76.17,16.05 77.44,14.79 U$1.D-
DGND
  Bottom 1.524: 12VPWR.1 64.93,4.77
  Bottom 5.588: D5.C 88.01,4.77 12VPWR.1
DTR
  Top 0.305: U1.13 83.22,16.77 83.48,16.52 86.14,16.52 86.3,16.37 86.3,14.95 86.86,14.39 95.59,14.39 96.31,15.11 96.31,25.45 95.43,26.32 95.43,36.57 95.16,36.84 83.46,36.84 82.82,36.21 C4.1
E0-DIR  (via drill 1 pad 1.78)
  Top 0.305: IC1.72 50.27,58.88 51.6,60.21 53.76,60.21 54.23,60.68 v54.23,62.24
  Bottom 0.305: EXTERNAL-EXTRUDER.2 30.61,61.4 34.81,57.19 54.18,57.19 | 54.18,57.19 57.17,57.19 58.84,58.87 U$2.DIR | v54.23,62.24 54.23,57.24 54.18,57.19
E0-EN  (via drill 1 pad 1.78)
  Top 0.305: IC1.76 46.77,57.67 45.38,59.06 R27.2 44.21,59.09 v39.96,59.09 v39.95,59.08
  Bottom 0.305: U$2.EN 41.06,64.12 42,63.18 42,59.47 41.6,59.08 v39.95,59.08 34.23,59.08 32.35,60.96 32.35,91.46 31.84,91.97 29.1,91.97 EXTERNAL-EXTRUDER.1
E0-HOTEND  (via drill 1 pad 1.78)
  Top 0.305: IC1.23 59.77,39.21 60.52,38.47 v61.52,38.47 | R10.1 R13.1 57.04,19.19 57.51,19.66 v57.51,22.43
  Bottom 0.305: v61.52,38.47 61.52,26.12 57.82,22.43 v57.51,22.43
E0-STEP  (via drill 1 pad 1.78)
  Top 0.305: IC1.74 49.27,59.13 51.85,61.7 v51.85,62.24
  Bottom 0.305: v51.85,62.24 51.85,62.49 52.11,62.75 | v51.85,62.24 51.85,63.68 52.33,64.17 54.18,64.17 55.73,64.17 56.3,64.73 U$2.STEP 56.3,68.09 56.89,68.68 59.4,68.68 60.13,67.95 60.13,59.02 57.56,56.46 34.3,56.46 25.43,65.33 25.43,91.4 26.84,92.81 34.09,92.81 35.6,91.3 X-MOTOR2.1 | v51.85,62.24 51.94,62.24
E0-THERMO  (via drill 1 pad 1.78)
  Top 0.305: IC1.84 43.91,51.54 42.67,52.79 40.41,52.79 36.88,56.32 32.23,56.32 30.46,58.08 R7.1 30.46,60.85 30,61.31 C27.+ 23.28,61.31 21.9,62.69 21.9,68.28 21.06,69.12 v18.98,69.12
  Bottom 0.305: THEROMO-0.2 7.89,64.29 12.73,69.12 v18.98,69.12
E0HOT
  Top 0.813: LED5.2 48.55,13.22 48.04,13.73 48.04,22.74 47.71,23.08 47.71,29.26 48.04,29.6 51.09,29.6 51.85,28.84 Q1.D
  Bottom 1.524: E0-HOTEND.1 48.05,5.91 48.05,15.76 51.85,19.57 Q1.D
E1-DIR  (via drill 1 pad 1.78)
  Top 0.305: IC1.56 58.27,59.19 59.86,60.78 75.61,60.78 79.13,64.29 82.71,64.29 84.83,62.17 v86.27,62.17
  Bottom 0.305: U$3.DIR 86.53,62.42 v86.27,62.17
E1-EN  (via drill 1 pad 1.78)
  Top 0.305: IC1.60 56.27,58.3 60.39,62.42 65.57,62.42 | 65.57,62.42 68.42,62.42 v68.92,62.92 | R28.2 65.57,62.42
  Bottom 0.305: U$3.EN 68.92,66.13 v68.92,62.92
E1-HOTEND  (via drill 1 pad 1.78)
  Top 0.305: R8.1 41.67,19.77 42.96,19.77 | 42.96,19.77 43.38,19.77 v43.38,18.47 | 43.28,19.77 45.11,19.77 R14.1 | IC1.18 57.27,34.52 v57.4,34.4 | 43.28,19.77 | 43.28,19.77 42.96,19.77
  Bottom 0.152: 48.29,22.51 50.58,24.8 50.58,27.95
  Bottom 0.305: 57.41,34.39 v57.4,34.4 57.4,34.39 57.4,28.91 56.9,28.4 55.23,28.4 55.22,28.41 51.04,28.41 50.58,27.95 | v43.38,18.47 43.47,18.55 45.89,18.55 48.29,20.96 48.29,22.51
E1-STEP  (via drill 1 pad 1.78)
  Top 0.305: IC1.54 59.27,59.06 59.66,59.45 79.2,59.45 80.14,60.39 v80.14,62.17
  Bottom 0.305: 83.6,66.31 U$3.STEP 83.98,63.52 82.64,62.17 v80.14,62.17
E1-THERMO  (via drill 1 pad 1.78)
  Top 0.305: IC1.82 45.17,52.54 43.36,54.35 41.16,54.35 37.7,57.81 32.87,57.81 32.53,58.15 32.53,71.2 30.46,73.27 R11.1 30.46,78.43 29.84,79.06 C8.+ 23.85,79.06 23.2,79.71 v19.59,79.71
  Bottom 0.305: THEROMO-2.2 7.77,80.13 8.2,79.69 19.58,79.69 v19.59,79.71
E1HOT
  Top 0.813: LED4.2 39.37,13.21 38.39,14.18 38.39,19.28 39.96,20.84 42.44,20.84 43.1,21.51 43.1,35.58 Q2.D
  Bottom 1.524: Q2.D 43.34,38.25 42.93,38.67 39.4,38.67 38.16,37.42 38.16,31 41.09,28.06 41.09,4.45 E1-HOTEND.1
E2-HOTEND  (via drill 1 pad 1.78)
  Top 0.305: IC1.15 55.77,38.8 54.92,37.95 v54.66,37.95 | R12.1 33.73,19.19 v34.31,18.61 34.31,18.87 34.63,19.19 R15.1
  Bottom 0.305: v34.31,18.61 38.44,18.61 39.25,19.41 39.25,27.62 36.76,30.11 36.76,38.26 38.56,40.06 43.62,40.06 45.74,37.94 46.98,37.94 49.53,35.39 53.16,35.39 54.66,36.89 v54.66,37.95
E2HOTEND
  Top 0.813: LED6.2 30.77,13.22 30.22,13.77 30.22,28.16 31.53,29.48 34.84,29.48 35.34,28.97 Q3.D
  Bottom 1.524: Q3.D 35.34,28.97 34.84,29.48 31.53,29.48 30.81,28.75 30.81,6.3 E2-HOTEND.1
E3-HOTEND  (via drill 1 pad 1.78)
  Top 0.305: IC1.24 60.27,40.27 62.28,40.27 v62.28,40.68 | v26.5,28.76 26.5,27.02 26.09,26.61 26.09,19.32 | R9.1 24.19,19.32 26.09,19.32 | 26.09,19.32 28.2,19.32 R16.1
  Bottom 0.305: v26.5,28.76 26.5,30.54 27.82,31.86 32.95,31.86 34.14,33.05 34.14,40.52 35.01,41.39 61.85,41.39 61.95,41.28 62.28,40.96 v62.28,40.69 v62.28,40.68
E3HOTEND
  Top 0.305: 7.64,20.25 7.61,20.22
  Top 0.813: Q4.D 28.11,38.46 14.77,38.46 7.64,31.33 7.64,20.25 7.64,13.79 9.44,12 23.73,12 24.06,12.34 LED3.2
  Bottom 1.524: Q4.D 28.11,34.58 24.2,30.68 24.2,25.95 26.62,23.53 26.62,9.23 24.58,7.19 E3-HOTEND.1
FAN-S
  Top 0.813: Q5.D 94.88,72.27 95.85,73.25 96.83,73.25 D2.ANODE
  Bottom 0.813: Q5.D 95.03,72.27 95.43,72.67 95.43,76.58 95.18,76.82 92.04,76.82 91.19,77.68 91.19,80.82 88.34,83.66 PART-COOLING-FAN.1
FANS  (via drill 1 pad 1.78)
  Top 0.305: v65.61,41.4 65.61,42.01 64.87,42.75 61.65,42.75 60.77,41.88 IC1.25 | R32.1 94.12,60.02 94.59,59.55 94.59,55.91 94.01,55.33 72.06,55.33 71.83,55.56 v68.56,55.56
  Top 0.813: R32.1 R33.1
  Bottom 0.305: v68.56,55.56 65.73,55.56 65.38,55.2 65.38,41.63 v65.61,41.4
GND  (via drill 1 pad 1.52, 1 pad 1.78)
  Top 0.305: IC1.99 44.78,44.04 | IC1.11 53.77,40.03 53.76,40.02 | IC1.81 45.72,53.04 44.26,54.5 | ISP.6 71.79,34.17 v71.79,31.89 71.79,31.63 | 72.72,25.08 71.92,25.08 71.34,25.66 72.45,25.66 C3.1 | 39.86,62.47 v39.86,62.52 | 54.9,55.64 55.27,56.01 IC1.62 55.28,58.94 54.77,58.94 54.71,58.88 | 59.47,47.76 60.7,46.54 IC1.32 68.32,46.54 68.94,45.92 70.08,45.92 | C2.1 80.2,40.02 79.67,39.48 78.47,39.48 | 81.13,15.57 81.14,15.56 81.14,14.84 81.1,14.81 | 70.02,45.98 70.08,45.92 | 70.08,45.92 70.63,45.37 72.97,45.37 | C1.1 78.34,39.75 77.3,39.75 76.13,40.92 | 79.48,14.15 79.37,14.27 79.91,14.81 | 76.95,39.75 76.86,39.84 76.42,39.84 76.42,39.32 | 76.42,39.32 76.4,39.3 | 76.42,39.32 76.08,39.67 75.89,39.67
  Bottom 0.305: X-MIN.2 114.93,17.48 | 114.67,52.02 113.79,52.02 | 113.79,52.02 Y-MAX.2 | X-MIN.2 114.99,17.48 115.44,17.93 115.44,29.04 | 115.44,29.04 115.44,40.53 | 115.44,40.53 115.44,51.96 | 115.44,51.96 115.44,63.14 | 115.44,63.14 115.44,74.44 | 115.44,74.44 113.72,74.44 Z-MAX.2 | 115.44,63.14 113.72,63.14 Z-MIN.2 | 115.44,51.96 113.85,51.96 113.79,52.02 | 115.44,40.53 113.72,40.53 Y-MIN.2 | 115.44,29.04 X-MAX.2 | v39.86,62.52 v39.87,62.51 34.8,62.51 33.1,64.22 33.1,82.94 33.74,83.57 38.86,83.57 39.1,83.81 X-MOTOR2.2 | 115.44,74.44 115.44,78.86 114.46,79.83 112.12,79.83 108.27,83.68 108.27,90.51 105.92,92.86 89.03,92.86 | 1.97,60.77 1.97,44.19 1.96,44.18 1.96,44.02 | 1.96,76.95 1.96,81.19 3.53,82.76 12.74,82.76 15.6,85.62 v15.63,85.62 | 5.34,11.97 1.96,11.97 | 1.96,11.97 1.96,26.8 1.96,27.73 | 1.96,11.97 2.06,11.87 XMOTOR2.1 | X-MOTOR2.2 39.1,91.02 | U$2.GND 59.77,79 60.41,78.36 62.18,78.36 62.95,79.13 62.95,92.73 62.82,92.86 | 85.22,89.08 85.25,89.05 | 85.25,89.05 85.25,87.51 85.24,87.5 85.24,82.44 86.53,81.15 U$3.GND | 1.96,27.73 1.96,44.02 | THEROMO-0.1 1.98,60.79 1.97,60.77 | 1.97,76.95 1.96,76.95 | 1.97,60.77 1.97,68.59 | 1.97,68.59 1.97,68.81 THEROMO-1.1 | YMOTOR2.1 1.99,27.7 1.96,27.73 | 5V-PWR.1 15.63,86.31 v15.63,85.62 | v15.63,85.62 v15.63,85.61 | v70.52,25.66 70.52,27.96 71.79,29.23 v71.79,31.89 74.48,31.89 76.14,33.55 BLTOUCH.1 | Z-MOTOR2.1 1.96,44.02 | 1.96,76.95 1.96,76.61 | 1.96,76.61 1.96,68.59 1.97,68.59 | 1.96,76.61 1.98,76.63 THEROMO-2.1 9.24,76.63 v9.39,76.78 | X-MIN.2 104.89,17.48 v104.79,17.38 | 89.03,92.86 | 89.03,92.86 85.26,92.86 | 85.26,92.86 62.82,92.86 | 62.82,92.86 39.65,92.86 39.1,92.32 X-MOTOR2.2
  Bottom 0.305: 85.26,92.86 85.25,92.85 85.25,89.05
  Bottom 0.813: 39.19,89.98 X-MOTOR2.2
  pour Top (isolate 0.432): 116.81,0.19 116.81,93.53 1.08,93.53 1.08,0.19
HOT-BED
  Bottom 1.27: Q6.D 16.15,16.23 HOTBED.1
HOTBED  (via drill 1 pad 1.78)
  Top 0.305: IC1.17 56.77,37.67 54.91,35.8 v54.91,34.61 | v20.87,34.81 18.6,34.81 18.05,34.26 18.05,29.35 18.43,28.97 R35.1 20.34,26.68 19.9,26.24 R36.1
  Bottom 0.254: 63.95,26.42 63.95,44.79
  Bottom 0.305: 63.95,44.79 62.93,45.81 34.45,45.81 27.06,38.41 21.59,38.41 20.96,37.78 20.96,34.91 21.06,34.81 v20.87,34.81 | 63.95,26.42 57.86,20.34 56.26,20.34 55.8,20.8 55.8,23.16 60.43,27.8 60.43,36 59.77,36.66 55.78,36.66 54.91,35.79 v54.91,34.61
MISO
  Top 0.305: ISP.1 64.87,39.38 62.2,36.7 60.63,36.7 59.27,38.06 IC1.22
MOSI
  Top 0.305: IC1.21 58.77,36.91 60.11,35.57 62.2,35.57 64.75,38.11 67.92,38.11 69.19,36.84 ISP.4
N$1
  Top 0.305: IC1.33 74.11,47.04 CRYSTAL1.2 | CRYSTAL1.2 | C1.2 78.61,46.39 78,47 CRYSTAL1.2
N$2
  Top 0.305: IC1.34 68.05,47.54 69.16,48.65 83.42,48.65 83.66,48.41 CRYSTAL1.1 | 84.12,47.78 83.66,47.31 CRYSTAL1.1 | C2.2 81.32,44.52 81.59,44.79 83.39,44.79 83.66,45.05 CRYSTAL1.1
N$3
  Top 0.305: LED2.1 89.02,38.83 R31.1
N$4
  Bottom 0.813: U$3.2B 73.83,81.14 71.34,83.63 EXTRUDER22.1
N$5
  Bottom 0.813: U$3.2A 76.36,82.05 74.93,83.49 74.93,89.89 EXTRUDER22.2
N$6
  Bottom 0.813: U$3.1A 78.91,81.8 79.67,82.56 79.67,89.96 EXTRUDER2.1
N$7
  Top 0.305: LED.1 R4.2
N$8
  Top 0.305: LED1.1 89.99,16.67 R5.2
N$9
  Bottom 0.813: U$3.1B 81.44,81.3 83.27,83.12 83.27,89.85 EXTRUDER2.2
N$10
  Top 0.813: R33.2 90.78,65.42 90.26,65.94 90.26,74.33 90.74,74.81 Q5.G
N$12
  Top 0.305: Q4.G 30.64,32.76 28.2,30.31 28.2,22.61 R16.2
N$13  (via drill 1 pad 1.78)
  Top 0.813: R15.2 36.45,22.63 34.75,22.63 v34.31,23.07
  Bottom 0.813: v34.31,23.07 37.32,23.07 37.88,23.63 Q3.G
N$14
  Top 0.813: LED3.1 28.3,16.51 R17.2
N$15
  Top 0.813: LED6.1 R18.2
N$16
  Top 0.305: R36.2 9.83,26.24 9.17,25.58 9.17,14.32 9.52,13.97 17.89,13.97 18.31,14.39 Q6.G
N$29
  Bottom 0.305: JP1.5 56.93,70.51 55.28,68.86 49.3,68.86 48.68,68.24 U$2.MS3
N$30
  Bottom 0.305: U$2.RST U$2.SLP
N$31
  Bottom 0.406: U$3.RST U$3.SLP
N$32  (via drill 1 pad 1.78)
  Top 0.305: R26.1 74.43,69.35 71.31,69.35 v71.28,69.33
  Bottom 0.305: U$3.MS1 v71.28,69.33 71.28,70.29 71.83,70.84 JP4.1
N$33  (via drill 1 pad 1.78)
  Top 0.305: R23.2 49.06,69.35 48.69,69.73 v48.69,71.38
  Bottom 0.305: U$2.MS1 43.6,68.84 47.41,72.66 48.69,72.66 | 48.69,72.66 51.35,72.66 JP1.1 | v48.69,71.38 48.69,72.66
N$36
  Bottom 0.305: U$2.MS2 46.14,68.46 47.28,69.61 53.72,69.61 54.39,70.29 JP1.3
N$37
  Bottom 0.406: U$3.MS3 76.36,68.01 76.71,68.36 84.9,68.36 85.77,69.23 JP4.5
N$38
  Bottom 0.406: U$3.MS2 73.83,68.49 74.61,69.28 82.74,69.28 83.23,69.77 JP4.3
N$39
  Bottom 0.813: U$2.2B 46.14,81.87 44.1,83.92 EXTRUDER11.1
N$40
  Bottom 0.61: U$2.2A
  Bottom 0.813: EXTRUDER11.2 47.62,89.96 47.62,82.98 48.68,81.93 U$2.2A
N$41
  Bottom 0.61: U$2.1A
  Bottom 0.813: U$2.1A 51.22,82.2 52.34,83.32 EXTRUDER1.1
N$42
  Bottom 0.813: U$2.1B 53.76,81.34 55.84,83.42 EXTRUDER1.2
N$45
  Top 0.813: R24.2 LED4.1
N$47
  Top 0.305: Q2.G 45.88,32.95 45.7,32.76 R14.2
N$48
  Top 0.813: Q1.G 54.39,24.14 53.63,23.38 R13.2
N$50
  Top 0.813: LED5.1 R25.2
PGND  (via drill 1 pad 1.52, 1 pad 1.78)
  Top 0.305: Q2.S 40.8,38.96 U$4.2
  Top 0.813: Q6.S 13.23,21.5 14.22,22.49 R9.2 24.06,32.23 | Q4.S 24.57,35.83 24.06,35.31 24.06,32.23 | 24.06,32.23 24.02,32.27 R35.2
  Top 1.016: R12.2 32.02,21.15 32.35,20.82 38,20.82 39.59,22.41 41.01,22.41 R8.2 | 105.03,85.43 104.55,84.94 v104.47,84.94 | Q5.S 94.06,69.73 94.59,69.2 94.59,64.09 94.24,63.74 88.91,63.74 88.61,64.04 | C14.- 76.56,73.92 | 77.94,75.3 v78,75.3 v78.01,75.31 | v34.88,79.61 v34.87,79.61 | 46.51,73.54 46.9,73.92 C13.- | Q1.S 49.31,24.82 50.08,24.05 R10.2
  Top 1.27: R12.2 32.02,24.08 32.8,24.86 Q3.S | R8.2 41.09,35.54 Q2.S 37.07,35.83 32.25,40.65 14.16,40.65 6.98,33.47 2.28,33.47 | R32.2 89.68,56.72 88.61,57.78 88.61,64.04 88.61,73.96 87.26,75.31 v78.01,75.31 | 77.94,75.3 76.56,73.92 | v34.87,79.61 33.86,79.61 33.08,80.4 33.08,84.38 32.97,84.49 | v34.88,79.61 35.39,79.61 35.79,79.2 35.79,73.01 37.83,70.97 46.16,70.97 46.51,71.33 46.51,73.54 | 94.03,86.68 94.03,79.57 D1.ANODE | 2.28,33.47 2.28,80.81 3.78,82.31 10.99,82.31 13.11,84.43 13.11,88.06 13.58,88.53 17.66,88.53 21.71,84.49 32.97,84.49 | 2.28,33.47 2.28,22.19 | 2.28,21.6 2.28,22.19 | 2.28,22.19 2.29,22.19 2.29,10.5 3.16,9.63 11.56,9.63 v12.18,9.02 | 32.97,84.49 63.21,84.49 64.55,85.83
  Top 2.54: 108.06,11.51 105.82,9.27 D5.A 104.65,8.52 104.25,8.52 104.2,8.46 104.2,4.58 | 108.06,11.51 108.75,12.19 108.75,80.67 v104.47,84.94 102.73,86.69 102.73,86.68 94.03,86.68 62.48,86.68 61.62,85.83 | 104.2,4.58 107.7,4.58 107.78,4.66 | 107.78,4.66 107.78,8.92 105.47,8.92 105.47,8.08 | 105.47,8.08 105.47,6.08 105.52,6.03 106.1,6.03 | 104.2,4.58 96.4,4.58 96.37,4.55 95.99,4.93 95.99,6.87 | 95.99,6.87 95.99,8.08 105.47,8.08 | 95.99,6.87 97.41,6.87 97.57,6.71 102.19,6.71 | 108.06,11.51 108.06,4.94 107.78,4.66 | 67.72,87.61 67.92,87.41 67.92,85.63 66.78,84.49 60.13,84.49 59.24,85.38 59.24,88.91 66.43,88.91 67.72,87.61 | 67.72,87.61 61.45,87.61 61.32,87.48 61.32,86.14 61.62,85.83 | 61.62,85.83 64.55,85.83 66.32,85.83
  Bottom 0.813: 40.77,35.79 Q2.S
  Bottom 1.016: v104.47,84.94 104.47,87.05 103.87,87.66 98.53,87.66 EXTRUDERFAN.1 96.22,81.01 97.01,80.22 97.01,71.31 95.44,69.73 Q5.S | v78,75.3 76.22,75.3 74.88,76.64 71.81,76.64 71.28,77.17 U$3.GND@0 | v34.88,79.61 34.88,81.44 35.67,82.23 43.03,82.23 43.6,81.66 U$2.GND@0
  Bottom 1.27: v12.18,9.02 12.38,9.02 13.23,9.87 Q6.S
  Bottom 1.524: Q1.S 46.2,26.3 40.77,31.73 40.77,35.79
RST
  Top 0.305: IC1.30 65.91,45.54 66.65,44.8 67.85,44.8 68.81,43.84 68.81,39.06 69.81,38.06 73.62,38.06 74.39,37.29 74.39,36.21 | R1.1 74.39,35.7 | ISP.5 68.3,34.3 69.62,35.62 74.31,35.62 74.39,35.7 | C4.2 74.39,36.21 | 74.39,36.21 74.39,35.7
RX
  Top 0.305: IC1.2 49.27,39.59 48.32,38.63 48.32,35.37 54.28,29.41 66.57,29.41 68.16,27.82 86.02,27.82 86.27,28.08 86.27,29.09 | 86.4,28.97 86.27,29.09 | 86.27,29.09 R2.1
RX-340
  Top 0.305: LED1.2 85.38,19.95 84.49,20.84 U1.3 84.49,24.29 83.54,25.24 R3.2
SCK
  Top 0.305: IC1.20 58.27,36.01 59.58,34.71 62.8,34.71 64.94,36.84 ISP.3
TOUCH  (via drill 1 pad 1.78)
  Top 0.305: IC1.26 66.75,43.54 67.12,43.17 v67.12,43.11
  Bottom 0.305: BLTOUCH.3 67.48,42.76 v67.12,43.11
TX
  Top 0.305: R3.1 68.17,29.16 67.13,30.2 54.69,30.2 49.09,35.79 49.09,38.34 49.77,39.02 IC1.3
TX-340
  Top 0.305: U1.2 85.76,24.45 86.21,24.89 R2.2 88.35,25.86 88.77,25.44 LED.2
V3
  Top 0.305: U1.4 83.21,23.39 83.21,24.28 82.91,24.59 79.22,24.59 78.72,25.08 C3.2
VD
  Bottom 0.305: 5V-JUMPER.1 19.71,66.5 20.43,67.22 D3.C
VO
  Top 0.305: C10.2 23.22,76.54 23.42,76.33 23.42,74.89 D3.A
  Bottom 0.305: 5V-PWR.2 22.8,80.61 23.37,80.04 D3.A
VUSB
  Top 0.305: 76.59,8.69 U$1.VBUS 76.64,10.57 76.3,10.91 70.71,10.91 69.94,10.14 C23.2 68.31,8.41 68.09,8.63 USB-JUMPER.1
X-DIR  (via drill 1 pad 1.78)
  Top 0.305: IC1.96 43.26,45.54 42.52,44.8 30.11,44.8 | 30.11,44.8 v29.84,44.8 | 30.11,44.8
  Bottom 0.305: X-MOTOR.1 7.36,19.88 10.26,22.77 10.26,31.83 23.98,45.55 27.51,45.55 28.27,44.8 v29.84,44.8
X-EN  (via drill 1 pad 1.78)
  Top 0.305: v29.84,47.12 31.14,47.12 32.2,46.06 46.75,46.06 IC1.95
  Bottom 0.305: v29.84,47.12 28.25,47.12 27.54,46.41 23.55,46.41 9.28,32.14 9.28,25.56 7.1,23.38 X-MOTOR.2
X-MAX  (via drill 1 pad 1.78)
  Top 0.305: IC1.38 67.92,49.54 68.79,50.4 92.75,50.4 94.41,48.75 94.41,41.11 97.88,37.64 97.88,30.13 | C16.2 97.9,30.11 97.88,30.13 | 97.88,30.13 | R20.2 100.13,27.76 97.88,27.76 v97.88,27.79 97.88,30.13
  Bottom 0.305: v97.88,27.79 97.88,31.69 98.73,32.54 X-MAX.1
X-MIN  (via drill 1 pad 1.78)
  Top 0.305: R19.2 100.24,16.88 | 100.24,16.88 C15.2 98.24,18.93 97.97,19.2 97.97,24.86 96.19,26.65 96.19,38.29 93.67,40.8 93.67,48.44 92.45,49.67 69.12,49.67 68.49,49.04 IC1.37 | v98.09,16.87 100.23,16.87 100.24,16.88
  Bottom 0.305: X-MIN.1 100.81,20.98 98.09,18.26 v98.09,16.87
X-STEP  (via drill 1 pad 1.78)
  Top 0.305: v25.08,43.72 26.83,43.72 27.45,43.1 42.24,43.1 44.18,45.04 IC1.97
  Bottom 0.305: XMOTOR2.2 4.68,17.19 5.25,17.77 8.13,17.77 11.37,21 11.37,31.51 20.89,41.03 24.67,41.03 25.08,41.44 v25.08,43.72
XI
  Top 0.305: CRYSTAL2.2 59.95,18.09 C11.2 59.95,15.74 60.14,15.56 64.75,15.56 67.3,18.11 74.53,18.11 75.4,18.98 75.4,21.52 75.98,22.11 79,22.11 79.41,22.53 U1.7
XO
  Top 0.305: U1.8 77.11,23.39 72.44,23.39 71.25,22.2 71.25,19.89 CRYSTAL2.1 68.76,20.7 65.16,17.1 C12.2
Y-DIR  (via drill 1 pad 1.78)
  Top 0.305: IC1.93 42.39,47.04 41.37,48.07 33.52,48.07 31.69,49.89 22.49,49.89 18.58,45.99 v18.58,45.89
  Bottom 0.305: Y-MOTOR.1 6.71,35.7 16.51,45.5 18.19,45.5 v18.58,45.89
Y-EN  (via drill 1 pad 1.78)
  Top 0.305: IC1.92 43.07,47.54 41.7,48.91 33.72,48.91 31.97,50.66 29.4,50.66 29.25,50.81 v29.25,51.73
  Bottom 0.305: v29.25,51.73 23.57,51.73 21.01,49.18 9.25,49.18 8.32,48.25 8.32,40.12 7.39,39.2 Y-MOTOR.2
Y-MAX  (via drill 1 pad 1.78)
  Top 0.305: R22.2 100.24,51.95 | 100.24,51.95 C18.2 | 100.24,51.95 97.92,51.95 v97.68,51.72 | IC1.40 62.83,50.59 66.84,50.59 68.18,51.93 100.22,51.93 100.24,51.95
  Bottom 0.305: 113.59,55.45 Y-MAX.1 99.52,55.52 97.68,53.69 v97.68,51.72
Y-MIN  (via drill 1 pad 1.78)
  Top 0.305: R21.2 C17.2 96.77,41.41 v96.74,41.37 96.74,41.91 96.76,41.93 96.76,50.17 95.74,51.19 68.51,51.19 67.36,50.04 IC1.39
  Bottom 0.305: v96.74,41.37 96.74,43.42 97.28,43.97 Y-MIN.1
Y-STEP  (via drill 1 pad 1.78)
  Top 0.305: IC1.94 41.84,46.54 41.25,47.13 33.29,47.13 31.53,48.88 28.58,48.88 27.8,48.09 v25.05,48.09
  Bottom 0.305: YMOTOR2.2 4.7,31.23 7.08,31.23 23.95,48.09 v25.05,48.09
Z-DIR  (via drill 1 pad 1.78)
  Top 0.305: IC1.90 44.29,48.54 42.4,50.43 38.38,50.43 34.32,54.49 24.29,54.49 23.02,53.22 v20.95,53.22
  Bottom 0.305: v20.95,53.22 19.27,51.53 8.94,51.53 8.08,52.39 Z-MOTOR.1
Z-EN  (via drill 1 pad 1.78)
  Top 0.305: IC1.89 44.86,49.04 42.71,51.19 38.79,51.19 34.65,55.33 24.32,55.33 23.27,56.38 v20.95,56.38
  Bottom 0.305: v20.95,56.38 19.27,54.69 8.91,54.69 7.71,55.89 Z-MOTOR.2
Z-MAX  (via drill 1 pad 1.78)
  Top 0.305: 100.24,72.85 R30.2 v100.23,75.1 100.23,77.64 C20.2 | 100.24,72.85 100.24,72.78 | IC1.42 65.47,51.54 67.47,53.54 95.49,53.54 96.1,54.15 96.1,62.43 97.36,63.68 97.36,69.54 98.82,71 99.77,71 100.23,71.47 100.23,72.84 100.24,72.85
  Bottom 0.305: v100.23,75.1 100.23,77 101.11,77.88 Z-MAX.1
Z-MIN  (via drill 1 pad 1.78)
  Top 0.305: R29.2 100.24,63.13 | 100.24,63.13 C19.2 | IC1.41 62.8,51.07 66.27,51.07 67.87,52.66 95.79,52.66 97.86,54.73 97.86,61.47 v97.78,61.55 97.78,62.37 98.54,63.13 100.24,63.13
  Bottom 0.305: v97.78,61.55 97.78,65.37 99.11,66.7 Z-MIN.1
Z-STEP  (via drill 1 pad 1.78)
  Top 0.305: IC1.91 43.74,48.04 42.12,49.67 35.29,49.67 34.71,50.25 v34.71,51.61
  Bottom 0.305: v34.71,51.61 32.72,51.61 30.89,53.44 24.02,53.44 20.76,50.17 9.15,50.17 6.5,47.52 Z-MOTOR2.2